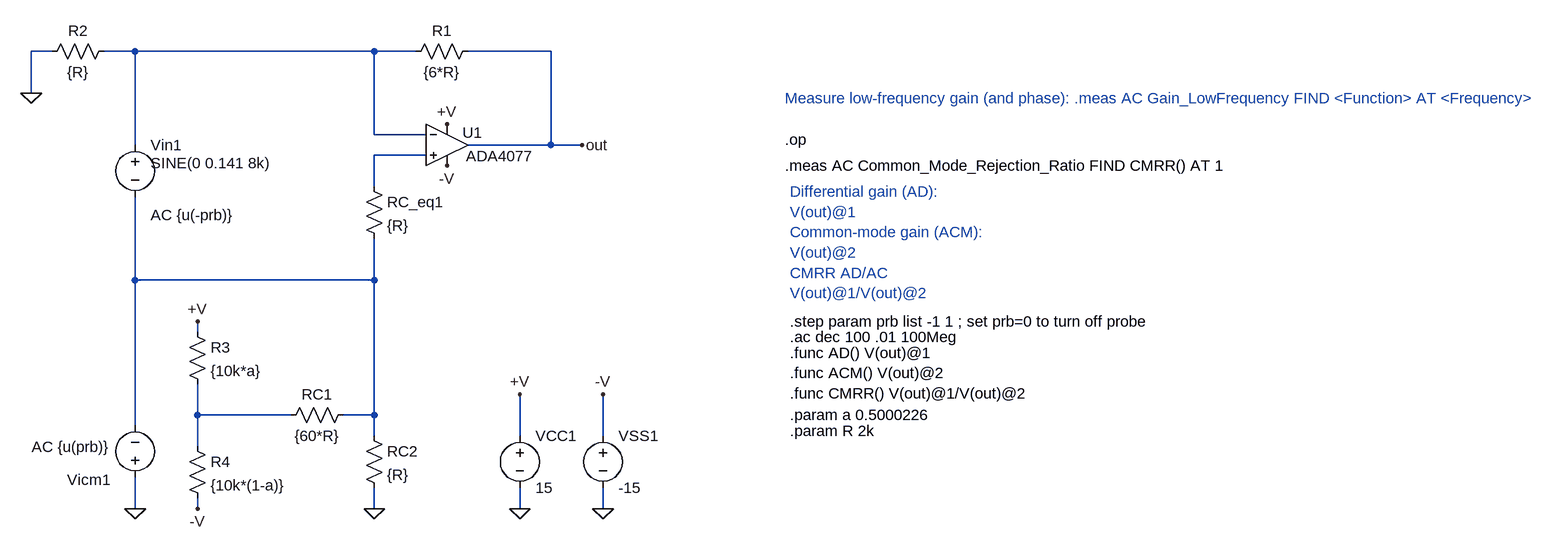
[diagram p0: schematic CMRR.asc]
CMRR.asc, the LTspice schematic file:
Version 4
SHEET 1 1436 680
WIRE -944 -304 -976 -304
WIRE -816 -304 -864 -304
WIRE -448 -304 -816 -304
WIRE -384 -304 -448 -304
WIRE -176 -304 -304 -304
WIRE -976 -240 -976 -304
WIRE -448 -176 -448 -304
WIRE -368 -176 -448 -176
WIRE -816 -160 -816 -304
WIRE -176 -160 -176 -304
WIRE -176 -160 -304 -160
WIRE -128 -160 -176 -160
WIRE -368 -144 -448 -144
WIRE -448 -96 -448 -144
WIRE -816 48 -816 -80
WIRE -448 48 -448 -16
WIRE -448 48 -816 48
WIRE -720 128 -720 112
WIRE -720 256 -720 208
WIRE -576 256 -720 256
WIRE -448 256 -448 48
WIRE -448 256 -496 256
WIRE -816 272 -816 48
WIRE -448 288 -448 256
WIRE -224 288 -224 224
WIRE -96 288 -96 224
WIRE -720 304 -720 256
WIRE -816 400 -816 352
WIRE -720 400 -720 384
WIRE -448 400 -448 368
WIRE -224 400 -224 368
WIRE -96 400 -96 368
FLAG -224 400 0
FLAG -96 400 0
FLAG -224 224 +V
FLAG -96 224 -V
FLAG -336 -128 -V
FLAG -336 -192 +V
FLAG -128 -160 out
FLAG -816 400 0
FLAG -720 112 +V
FLAG -720 400 -V
FLAG -448 400 0
FLAG -976 -240 0
SYMBOL voltage -816 -176 R0
WINDOW 123 24 124 Left 2
WINDOW 39 0 0 Left 2
WINDOW 3 24 44 Left 2
SYMATTR Value2 AC {u(-prb)}
SYMATTR Value SINE(0 0.141 8k)
SYMATTR InstName Vin1
SYMBOL res -288 -320 R90
WINDOW 0 0 56 VBottom 2
WINDOW 3 32 56 VTop 2
SYMATTR InstName R1
SYMATTR Value {6*R}
SYMBOL res -848 -320 R90
WINDOW 0 0 56 VBottom 2
WINDOW 3 32 56 VTop 2
SYMATTR InstName R2
SYMATTR Value {R}
SYMBOL voltage -224 272 R0
WINDOW 123 0 0 Left 2
WINDOW 39 0 0 Left 2
SYMATTR InstName VCC1
SYMATTR Value 15
SYMBOL voltage -96 272 R0
WINDOW 123 0 0 Left 2
WINDOW 39 0 0 Left 2
SYMATTR InstName VSS1
SYMATTR Value -15
SYMBOL res -464 -112 R0
SYMATTR InstName RC_eq1
SYMATTR Value {R}
SYMBOL OpAmps\\ADA4077 -336 -224 R0
WINDOW 0 24 45 Left 2
WINDOW 3 29 81 Left 2
SYMATTR InstName U1
SYMBOL voltage -816 368 R180
WINDOW 123 38 63 Left 2
WINDOW 39 0 0 Left 2
WINDOW 0 38 12 Left 2
WINDOW 3 -188 38 Left 2
SYMATTR Value2 AC {u(prb)}
SYMATTR InstName Vicm1
SYMATTR Value ""
SYMBOL res -592 272 R270
WINDOW 0 32 56 VTop 2
WINDOW 3 0 56 VBottom 2
SYMATTR InstName RC1
SYMATTR Value {60*R}
SYMBOL res -736 112 R0
SYMATTR InstName R3
SYMATTR Value {10k*a}
SYMBOL res -736 288 R0
SYMATTR InstName R4
SYMATTR Value {10k*(1-a)}
SYMBOL res -464 272 R0
SYMATTR InstName RC2
SYMATTR Value {R}
TEXT 192 112 Left 2 !.step param prb list -1 1 ; set prb=0 to turn off probe
TEXT 192 136 Left 2 !.ac dec 100 .01 100Meg
TEXT 184 -232 Left 2 ;Measure low-frequency gain (and phase): .meas AC Gain_LowFrequency FIND <Function> AT <Frequency>
TEXT 192 -88 Left 2 ;Differential gain (AD):\nV(out)@1\nCommon-mode gain (ACM):\nV(out)@2\nCMRR AD/AC\nV(out)@1/V(out)@2
TEXT 184 -128 Left 2 !.meas AC Common_Mode_Rejection_Ratio FIND CMRR() AT 1
TEXT 192 160 Left 2 !.func AD() V(out)@1\n.func ACM() V(out)@2\n.func CMRR() V(out)@1/V(out)@2
TEXT 184 -168 Left 2 !.op
TEXT 192 256 Left 2 !.param a 0.5000226
TEXT 192 280 Left 2 !.param R 2k

The netlist it stands for:
* CMRR.asc
Vin1 N001 N003 SINE(0 0.141 8k) AC {u(-prb)}
R1 out N001 {6*R}
R2 N001 0 {R}
VCC1 +V 0 15
VSS1 -V 0 -15
RC_eq1 N002 N003 {R}
XU1 N002 N001 +V -V out ADA4077  ; pins In+ In- V+ V- OUT
Vicm1 0 N003 AC {u(prb)}
RC1 N004 N003 {60*R}
R3 +V N004 {10k*a}
R4 N004 -V {10k*(1-a)}
RC2 N003 0 {R}
.step param prb list -1 1 ; set prb=0 to turn off probe
.ac dec 100 .01 100Meg
* Measure low-frequency gain (and phase): .meas AC Gain_LowFrequency FIND <Function> AT <Frequency>
* Differential gain (AD):
* V(out)@1
* Common-mode gain (ACM):
* V(out)@2
* CMRR AD/AC
* V(out)@1/V(out)@2
.meas AC Common_Mode_Rejection_Ratio FIND CMRR() AT 1
.func AD() V(out)@1
.func ACM() V(out)@2
.func CMRR() V(out)@1/V(out)@2
.op
.param a 0.5000226
.param R 2k
.backanno
.end